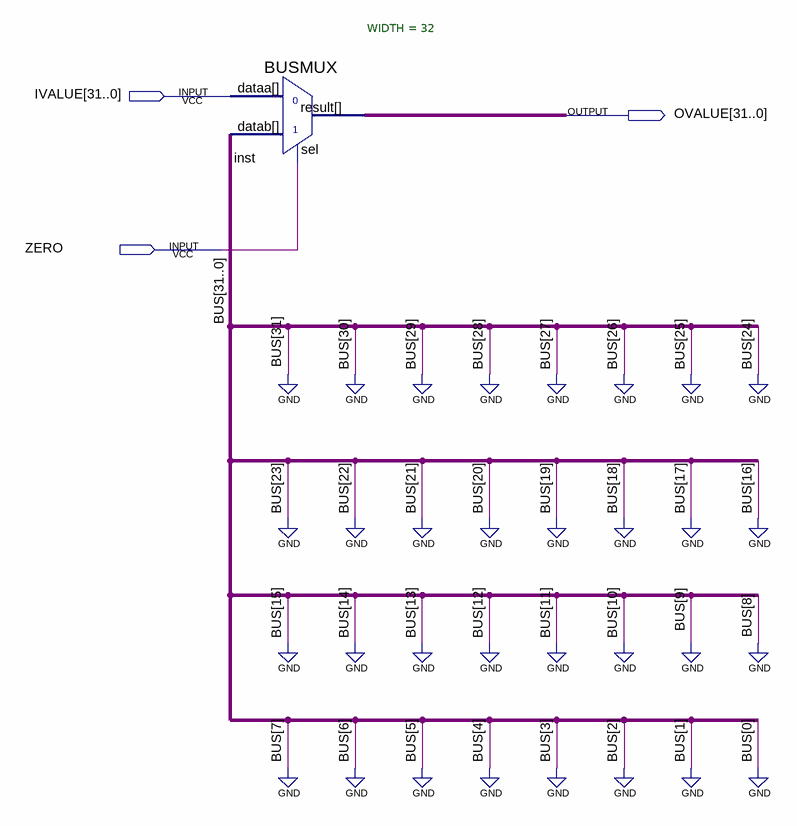
[diagram p0: schematic sheet]
// Quartus schematic SETZERO.bdf as structural Verilog: 1 symbols, 3 pins
module SETZERO (
  input  [31:0] IVALUE,
  input  ZERO,
  output [31:0] OVALUE
);

  BUSMUX #(.WIDTH(32)) inst (.datab({32{1'b0}}), .sel(ZERO), .dataa(IVALUE), .result(OVALUE));
endmodule
